# EAGLE design tiny_breadboard_21x21 (EAGLE 9.6.2)
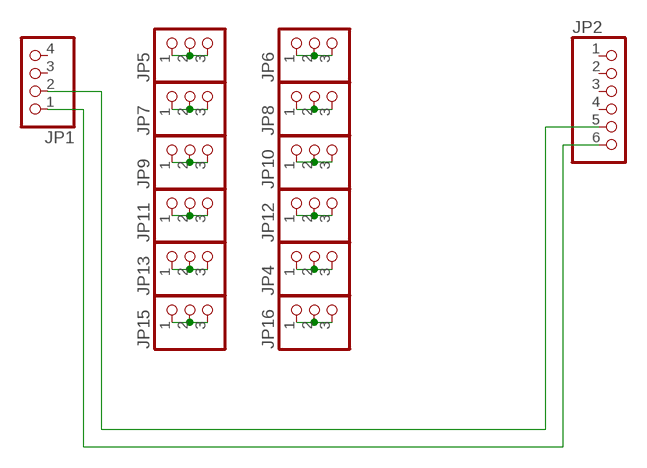
[diagram p0: schematic, sheet 1]

## Parts
JP1  PINHD-1X4  [1X04]
JP2  PINHD-1X6  [1X06]
JP4  PINHD-1X3  [1X03]
JP5  PINHD-1X3  [1X03]
JP6  PINHD-1X3  [1X03]
JP7  PINHD-1X3  [1X03]
JP8  PINHD-1X3  [1X03]
JP9  PINHD-1X3  [1X03]
JP10  PINHD-1X3  [1X03]
JP11  PINHD-1X3  [1X03]
JP12  PINHD-1X3  [1X03]
JP13  PINHD-1X3  [1X03]
JP15  PINHD-1X3  [1X03]
JP16  PINHD-1X3  [1X03]

## Nets
GND: JP1.2 JP2.5
N$2: JP15.1 JP15.2 JP15.3
N$3: JP13.1 JP13.2 JP13.3
N$4: JP11.1 JP11.2 JP11.3
N$5: JP9.1 JP9.2 JP9.3
N$6: JP7.1 JP7.2 JP7.3
N$7: JP5.1 JP5.2 JP5.3
N$9: JP4.1 JP4.2 JP4.3
N$10: JP6.1 JP6.2 JP6.3
N$11: JP8.1 JP8.2 JP8.3
N$12: JP10.1 JP10.2 JP10.3
N$13: JP12.1 JP12.2 JP12.3
N$15: JP16.1 JP16.2 JP16.3
VCC: JP1.1 JP2.6
Unconnected: JP1.3 JP1.4 JP2.1 JP2.2 JP2.3 JP2.4

## Library data of the parts
JP1 = pinhead2:PINHD-1X4: PIN HEADER
JP2 = pinhead2:PINHD-1X6: PIN HEADER
JP4-JP13 JP15 JP16 = pinhead2:PINHD-1X3: PIN HEADER

## Board
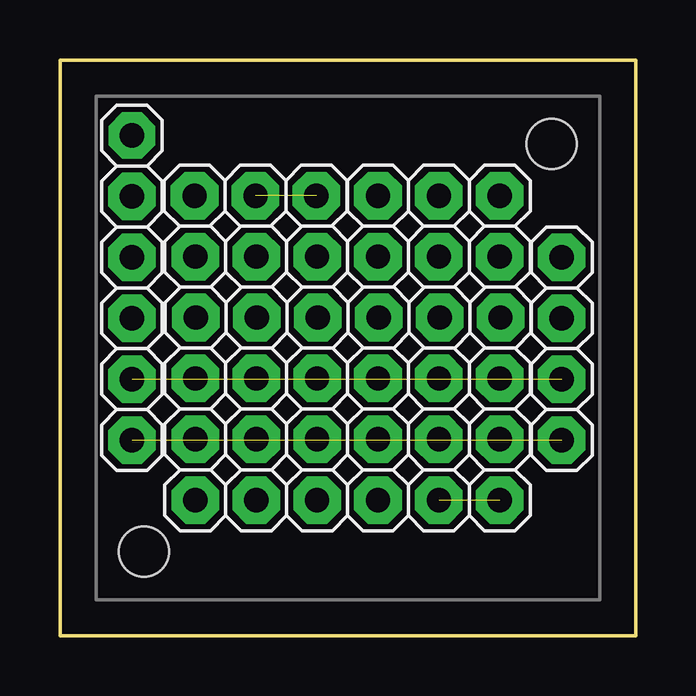
[diagram p1: board, top side]
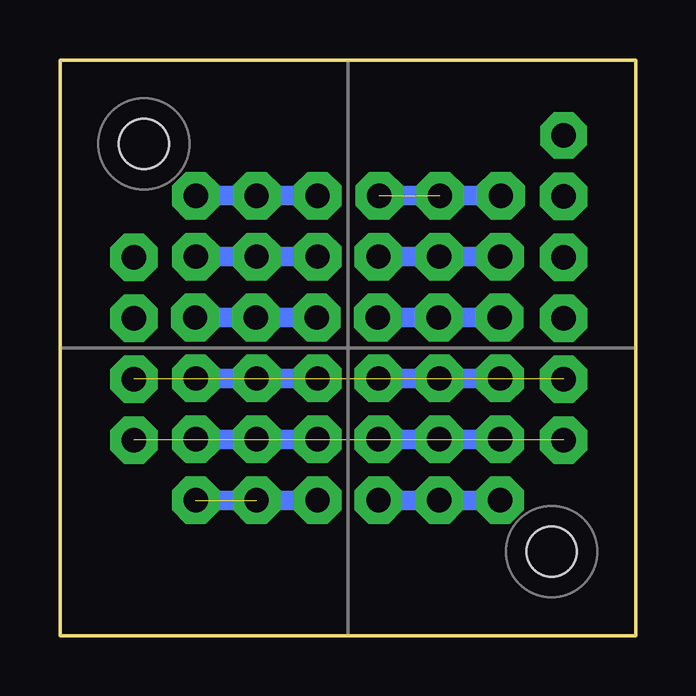
[diagram p2: board, bottom side, seen from below]

Size 24 x 24 mm. Coordinates in mm from the lower left corner, seen from the top.
Outline: 0,0 24,0 24,24 0,24 0,0
Copper layers (1*16): Top 0.035mm / dielectric 1.5mm / Bottom 0.035mm
Design rules "default *": minimum track width 14mil, minimum drill 0.35mm, track to track 14mil, track to pad 13mil, pad to pad 14mil, via to via 14mil, smd to smd 14mil, copper to edge 15mil, drill to drill 15mil, minimum pad ring 10mil, minimum via ring 8mil, stop-mask expansion 4mil, vias tented up to drill 0mil, thermal gap 10mil
Holes 2.1 mm at 20.5,20.5 3.5,3.5

### Footprints (pad centres in the part's own frame; a part is rotated, then mirrored left to right if it is on the bottom)
1X04 = drill 1.016 pad 1.981 octagon: 1 -3.81,0; 2 -1.27,0; 3 1.27,0; 4 3.81,0
1X06 = drill 1.016 pad 1.93 octagon: 1 -6.35,0 | drill 1.016 pad 1.981 octagon: 2 -3.81,0; 3 -1.27,0; 4 1.27,0; 5 3.81,0; 6 6.35,0
1X03 = drill 1.016 pad 1.981 octagon: 1 -2.54,0; 2 0,0; 3 2.54,0

### Placement (x,y rotation side)
JP1  20.92,11.96 90 top
JP2  3,14.5 270 top
JP4  15.8,18.34 0 top
JP5  8.18,15.8 0 top
JP6  15.8,15.8 0 top
JP7  8.21,13.26 0 top
JP8  15.83,13.26 0 top
JP9  8.18,10.72 0 top
JP10  15.8,10.72 0 top
JP11  8.18,8.18 0 top
JP12  15.8,8.18 0 top
JP13  8.18,5.64 0 top
JP15  15.8,5.64 0 top
JP16  8.15,18.34 0 top

### Tracks (layer width: path | path; a pad name or v marks a point on that pad's centre or on a via)
GND  (1 unrouted)
N$2  (1 unrouted)
  Bottom 0.813: JP15.1 JP15.3
N$3
  Bottom 0.813: JP13.1 JP13.2 JP13.3
N$4
  Bottom 0.813: JP11.3 JP11.2 JP11.1
N$5
  Bottom 0.813: JP9.1 JP9.2 JP9.3
N$6
  Bottom 0.813: JP7.3 JP7.2 JP7.1
N$7
  Bottom 0.813: JP5.1 JP5.2 JP5.3
N$9
  Bottom 0.813: JP4.3 JP4.2 JP4.1
N$10
  Bottom 0.813: JP6.3 JP6.2 JP6.1
N$11
  Bottom 0.813: JP8.1 JP8.2 JP8.3
N$12
  Bottom 0.813: JP10.3 JP10.2 JP10.1
N$13
  Bottom 0.813: JP12.1 JP12.2 JP12.3
N$15  (1 unrouted)
  Bottom 0.813: JP16.1 JP16.3
VCC  (1 unrouted)

### Text on the board
bDocu: A